# EAGLE design nola1 (EAGLE 8.3.2)
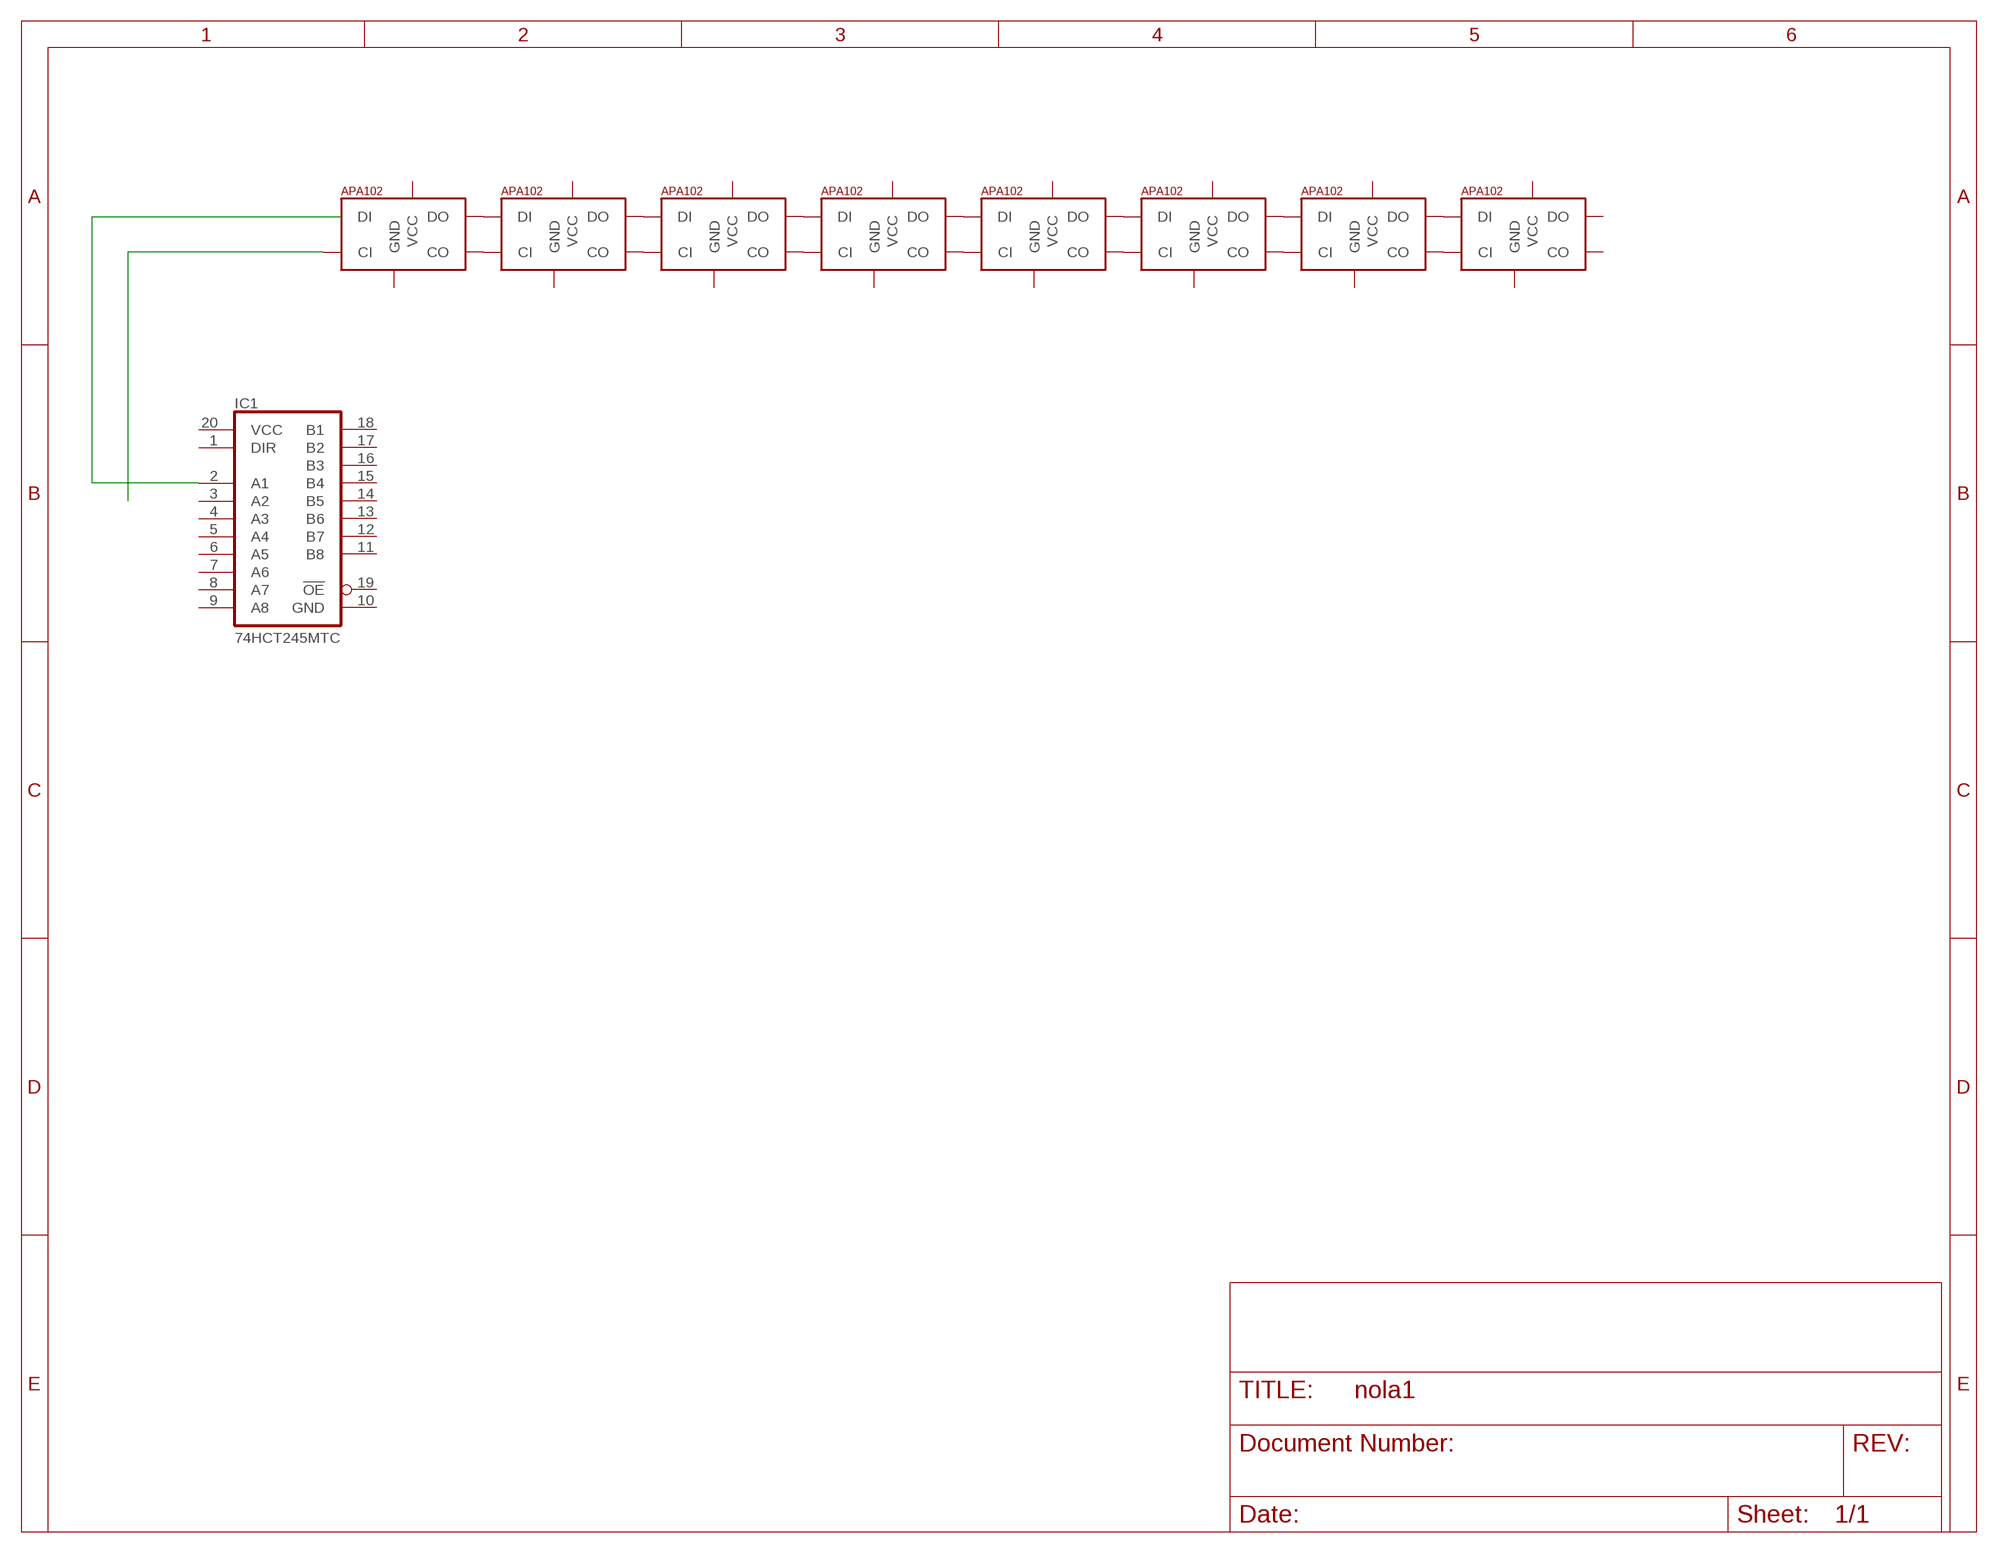
[diagram p0: schematic, sheet 1]

## Parts
IC1  74HCT245MTC  [SSOP20]
U$3  APA1025050  [APA102_5050]
U$4  APA1025050  [APA102_5050]
U$5  APA1025050  [APA102_5050]
U$6  APA1025050  [APA102_5050]
U$7  APA1025050  [APA102_5050]
U$8  APA1025050  [APA102_5050]
U$9  APA1025050  [APA102_5050]
U$10  APA1025050  [APA102_5050]

## Nets
N$1: U$3.3(DO) U$4.4(DI)
N$2: U$3.2(CO) U$4.5(CI)
N$3: U$4.3(DO) U$5.4(DI)
N$4: U$4.2(CO) U$5.5(CI)
N$5: U$5.3(DO) U$6.4(DI)
N$6: U$5.2(CO) U$6.5(CI)
N$7: U$6.3(DO) U$7.4(DI)
N$8: U$6.2(CO) U$7.5(CI)
N$9: U$7.3(DO) U$8.4(DI)
N$10: U$7.2(CO) U$8.5(CI)
N$11: U$8.3(DO) U$9.4(DI)
N$12: U$8.2(CO) U$9.5(CI)
N$13: U$9.3(DO) U$10.4(DI)
N$14: U$9.2(CO) U$10.5(CI)
N$15: IC1.2(A1)
N$16: U$3.5(CI)
Unconnected: IC1.1(DIR) IC1.3(A2) IC1.4(A3) IC1.5(A4) IC1.6(A5) IC1.7(A6) IC1.8(A7) IC1.9(A8) IC1.11(B8) IC1.12(B7) IC1.13(B6) IC1.14(B5) IC1.15(B4) IC1.16(B3) IC1.17(B2) IC1.18(B1) IC1.19(!OE) U$3.1(VCC) U$3.4(DI) U$3.6(GND) U$4.1(VCC) U$4.6(GND) U$5.1(VCC) U$5.6(GND) U$6.1(VCC) U$6.6(GND) U$7.1(VCC) U$7.6(GND) U$8.1(VCC) U$8.6(GND) U$9.1(VCC) U$9.6(GND) U$10.1(VCC) U$10.2(CO) U$10.3(DO) U$10.6(GND)

## Power pins joined to a net without a drawn wire
GND: IC1.10(GND)
VCC: IC1.20(VCC)

## Library data of the parts
IC1 = Ai_IC:74HCT245: Octal BUS TRANSCEIVER, 3-state
U$3-U$10 = jos-ph:APA102: APA102C 5050 RGB LED -- Adafruit DotStar Single LED Pixel Product Page: https://www.adafruit.com/products/2343 Datasheet: https://cdn-shop.adafruit.com/product-files/2343/APA102C.pdf

## Board
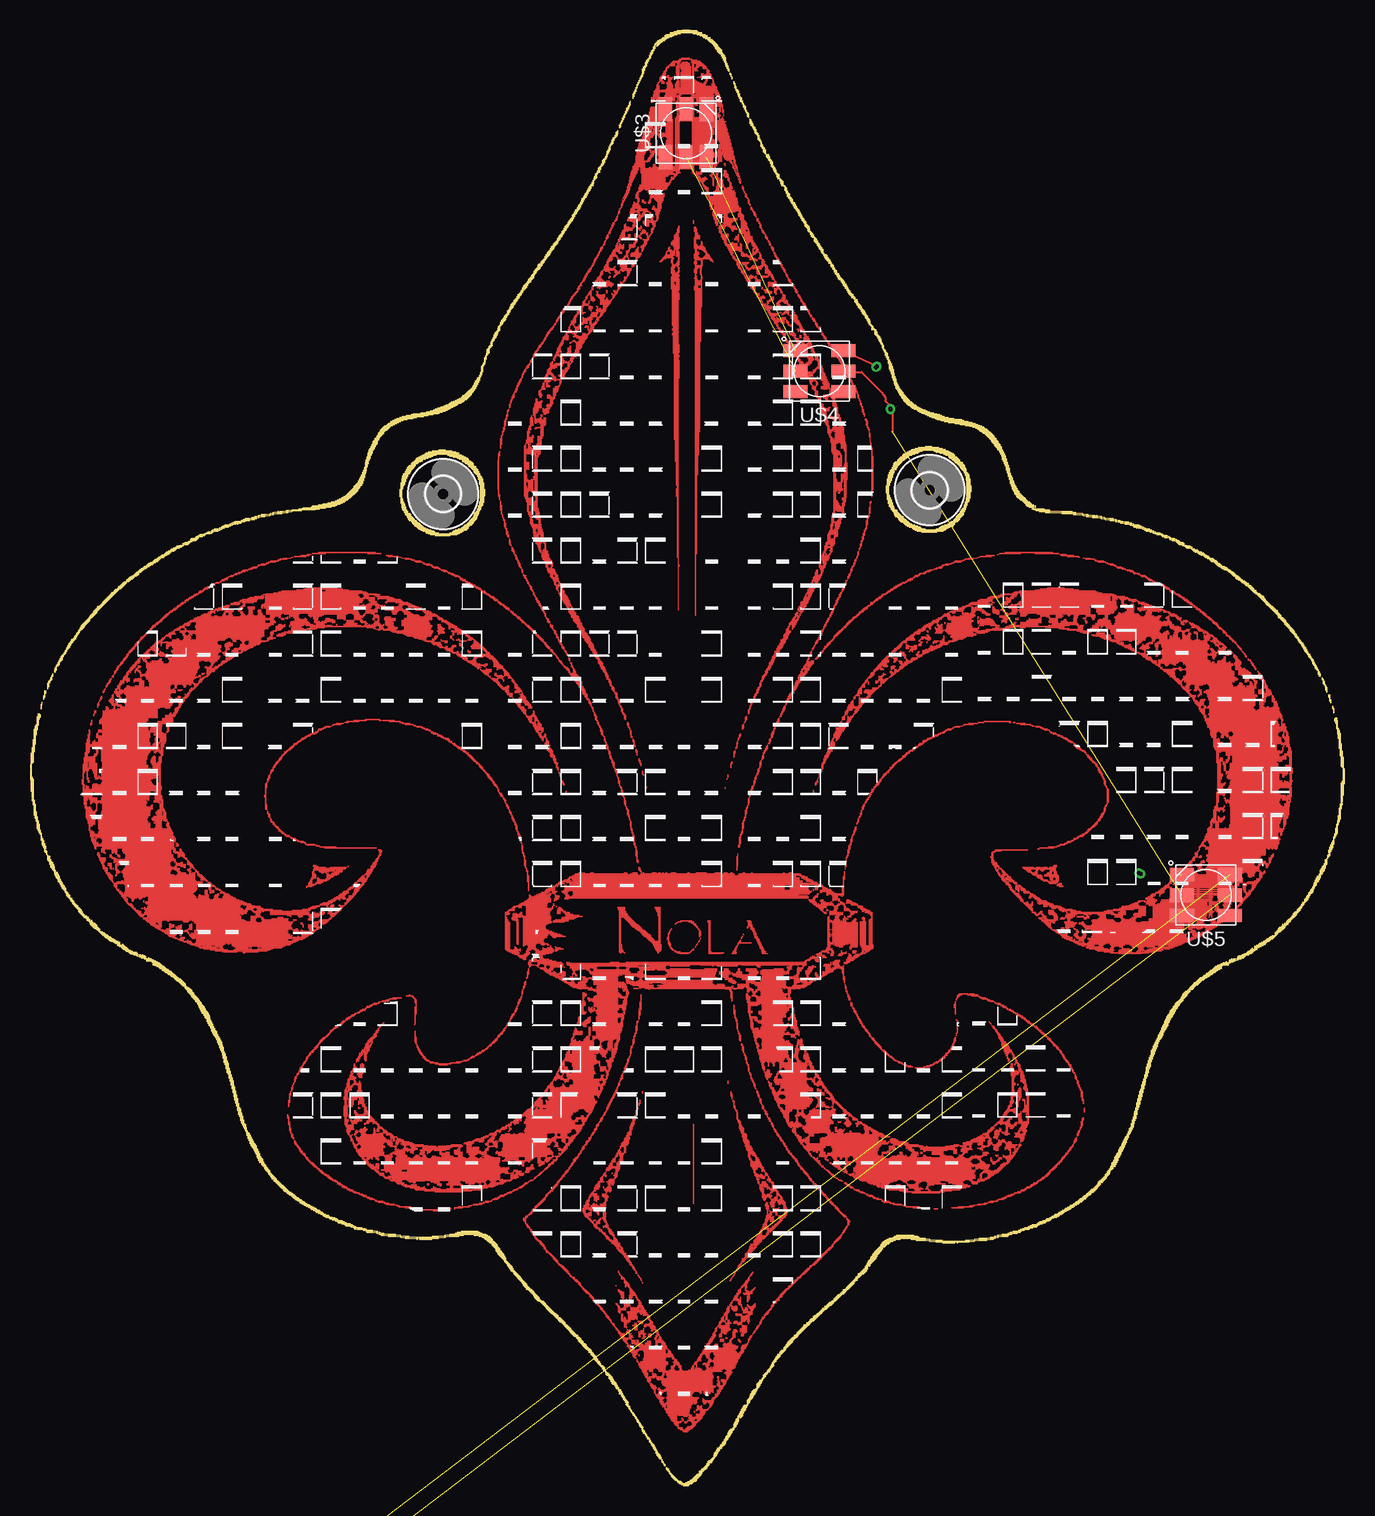
[diagram p1: board, top side]
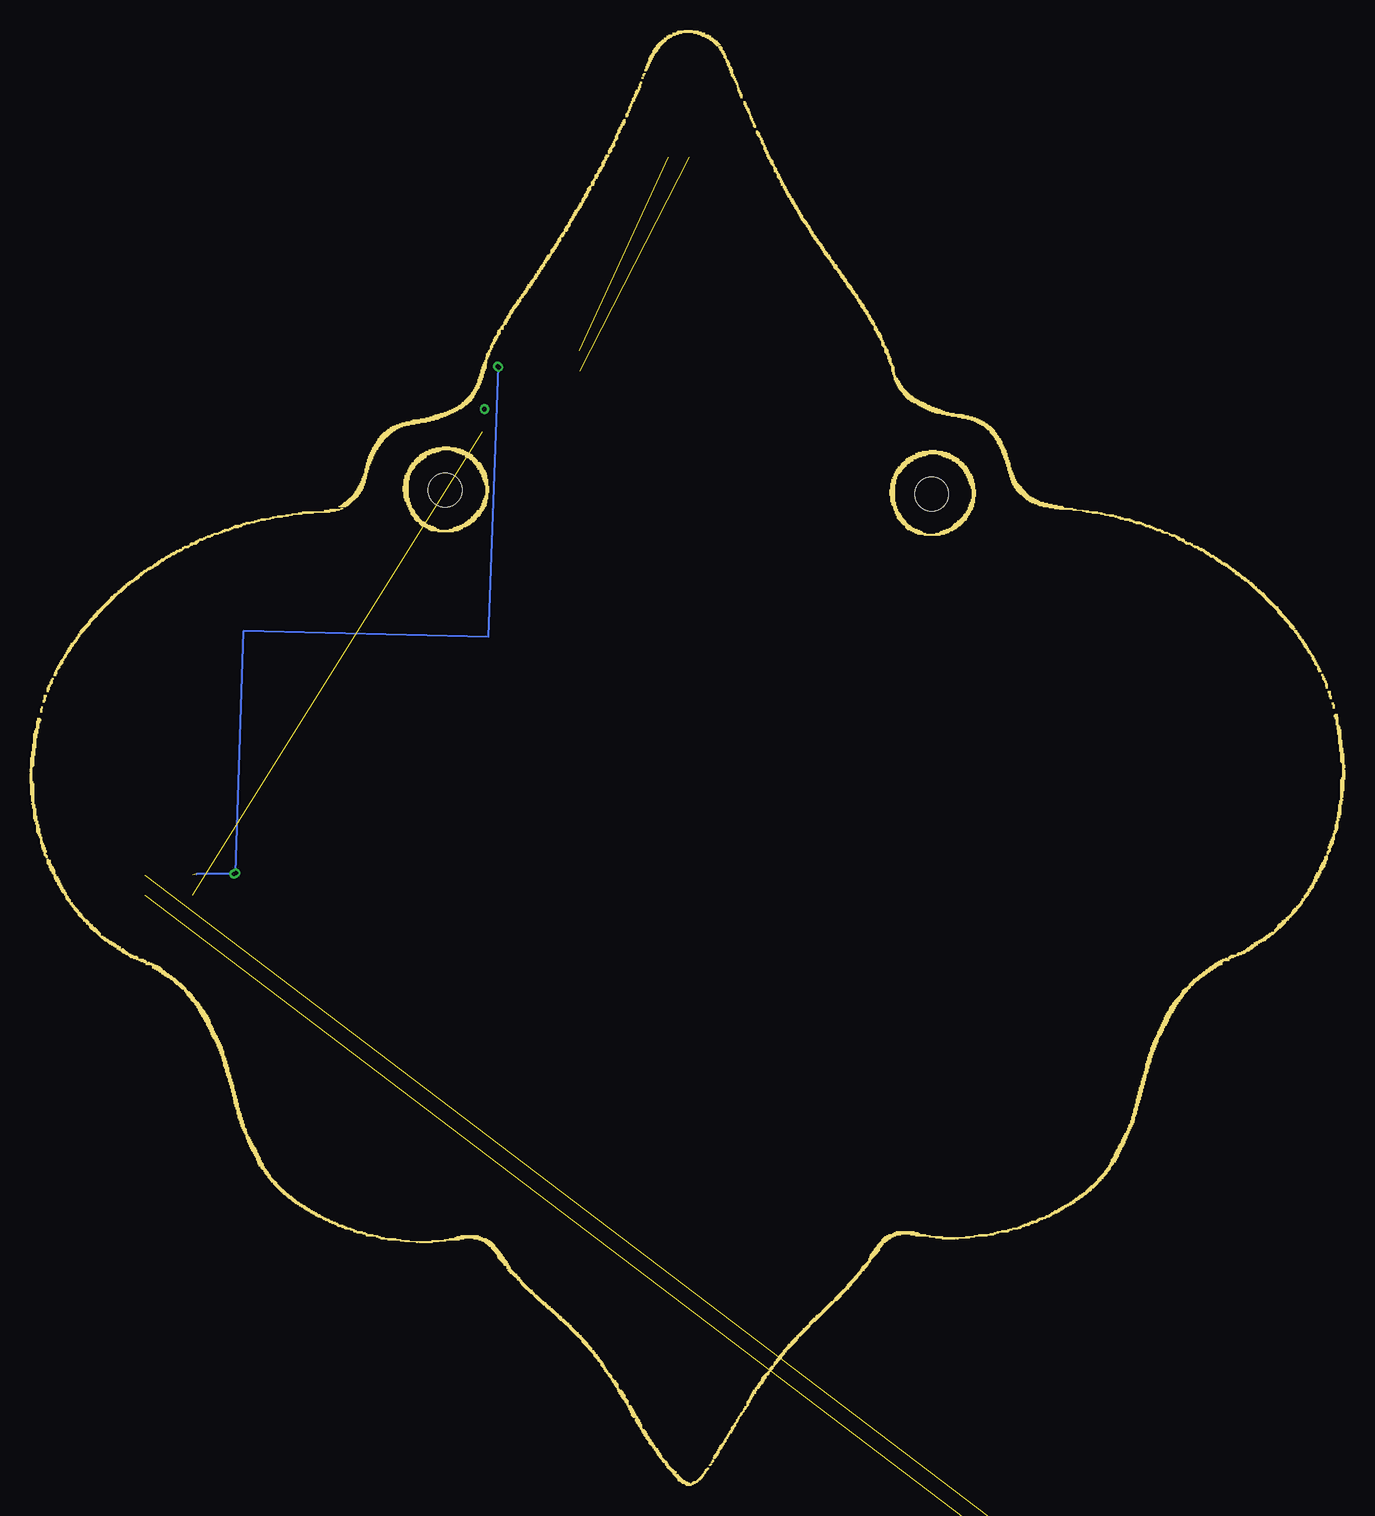
[diagram p2: board, bottom side, seen from below]

Size 109.6 x 121.36 mm. Coordinates in mm from the lower left corner, seen from the top.
Outline: 49.48,7.32 49.8,7 49.8,6.68
Outline: 49.72,6.76 49.96,6.52 49.96,6.44 50.12,6.28 50.12,6.2 50.36,5.96 50.36,5.88 50.52,5.72 50.52,5.64 50.68,5.48 50.68,5.32 50.84,5.16 50.84,5.08 51.08,4.84
Copper layers (1*16): Top 0.035mm / dielectric 1.5mm / Bottom 0.035mm
Design rules "default": minimum track width 6mil, minimum drill 0.35mm, track to track 6mil, track to pad 6mil, pad to pad 6mil, via to via 6mil, smd to smd 6mil, copper to edge 40mil, drill to drill 6mil, minimum pad ring 10mil, minimum via ring 8mil, stop-mask expansion 4mil, vias tented up to drill 0mil, thermal gap 10mil

### Footprints (pad centres in the part's own frame; a part is rotated, then mirrored left to right if it is on the bottom)
SSOP20 = smd 0.4 x 1.8: 1 -2.925,-3; 2 -2.275,-3; 3 -1.625,-3; 4 -0.975,-3; 5 -0.325,-3; 6 0.325,-3; 7 0.975,-3; 8 1.625,-3; 9 2.275,-3; 10 2.925,-3; 11 2.925,3; 12 2.275,3; 13 1.625,3; 14 0.975,3; 15 0.325,3; 16 -0.325,3; 17 -0.975,3; 18 -1.625,3; 19 -2.275,3; 20 -2.925,3
2,8 = hole 2.8: 0,0
APA102_5050 = smd 2 x 1.1: 1 2,-1.7; 2 2,0; 3 2,1.7; 4 -2,1.7; 5 -2,0; 6 -2,-1.7

### Placement (x,y rotation side)
IC1  -11.8,-61.48 0 top  (outside the outline)
U$1  [2,8]  34.44,82.68 0 top
U$2  [2,8]  75,83 0 top
U$3  54.68,112.76 270 top
U$4  65.8,92.92 0 top
U$5  98.04,49.24 0 top
U$6  -3.08,-30.68 0 top  (outside the outline)
U$7  -3.08,-38.44 0 top  (outside the outline)
U$8  -3.08,-46.2 0 top  (outside the outline)
U$9  -3.08,-53.96 0 top  (outside the outline)
U$10  -3.08,-61.72 0 top  (outside the outline)

### Tracks (layer width: path | path; a pad name or v marks a point on that pad's centre or on a via)
N$1  (1 unrouted)
N$2  (1 unrouted)
N$3  (via drill 0.35)  (1 unrouted)
  Top 0.152: U$4.3 v70.6,93.32
  Bottom 0.152: v70.6,93.32 71.4,70.76 91.8,71.24 v92.44,51.08 92.44,51 95.72,51
N$4  (1 unrouted)
  Top 0.152: U$4.2 67.88,92.84 69.32,92.84 71.07,91.09 71.07,91.07 71.23,90.91 71.23,90.83 71.31,90.75 71.31,90.43 71.88,89.86 71.88,87.88
N$5  (1 unrouted)
N$6  (1 unrouted)
N$7  (1 unrouted)
N$8  (1 unrouted)
N$9  (1 unrouted)
N$10  (1 unrouted)
N$11  (1 unrouted)
N$12  (1 unrouted)
N$13  (1 unrouted)
N$14  (1 unrouted)
N$17  (via drill 0.35)
  other vias: 70.52,93.24
N$18  (via drill 0.35)
  other vias: 92.6,51
N$19  (via drill 0.35)
  other vias: 71.72,89.8
N$20  (via drill 0.35)
  other vias: 71.72,89.72
(copper drawn outside any net)
  shapes: Top area x18648

### Text on the board
Top: /home/thedevilsvoice/workspace/badge_proto/images/nola/nola_eagle_layer1.bmp
Dimension: /home/thedevilsvoice/workspace/badge_proto/images/nola/nola_eagle_layer20.bmp
tPlace: /home/thedevilsvoice/workspace/badge_proto/images/nola/nola_eagle_layer21.bmp